# EAGLE design tempsens_tsys01 (EAGLE 7.5.0)
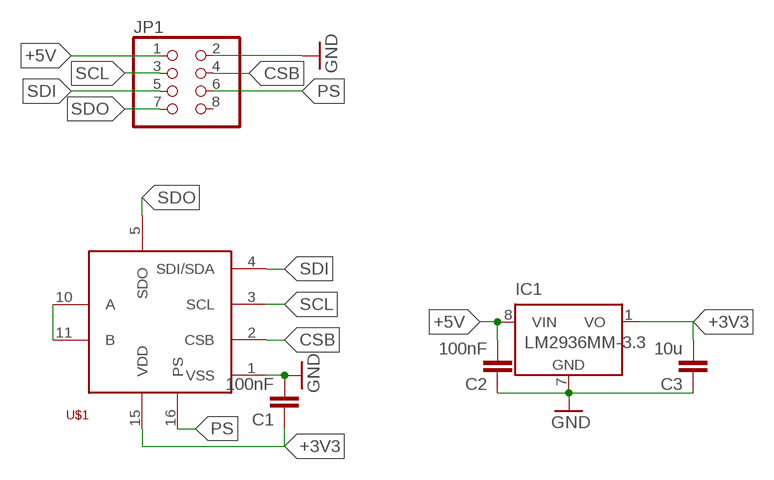
[diagram p0: schematic, sheet 1]

## Parts
C1  100nF  C-EUC0603K  [C0603K]
C2  100nF  C-EUC0603K  [C0603K]
C3  10u  C-EUC0805  [C0805]
IC1  LM2936MM-3.3  [MINI-SO8]
JP1  PINHD-2X4_2.00  [2X04M]
U$1  TSYS01NOPAD  [TSYS01_NOPAD]

## Nets
+3V3: C1.1 C3.2 IC1.1(VO) U$1.15(VDD)
+5V: C2.2 IC1.8(VIN) JP1.1
CSB: JP1.4 U$1.2(CSB)
GND: C1.2 C2.1 C3.1 IC1.7(GND) JP1.2 U$1.1(VSS)
N$3: U$1.10(A) U$1.11(B)
PS: JP1.6 U$1.16(PS)
SCL: JP1.3 U$1.3(SCL)
SDI: JP1.5 U$1.4(SDI/SDA)
SDO: JP1.7 U$1.5(SDO)
Unconnected: JP1.8

## Library data of the parts
C1 C2 = resistor:C-EU: CAPACITOR, European symbol
C3 = rcl:C-EU: CAPACITOR, European symbol
IC1 = national-semiconductor:LM2936?*: Ultra-Low Quiescent Current LDO Voltage Regulator Source: Data sheet <http://www.national.com/ds/LM/LM2936.pdf>; MF: NATIONAL SEMICONDUCTOR; MPN: LM2936MM-3.3/NOPB; OC_FARNELL: 1312706; OC_NEWARK: 41K4517
JP1 = pinhead:PINHD-2X4: PIN HEADER
U$1 = meas:TSYS01

## Board
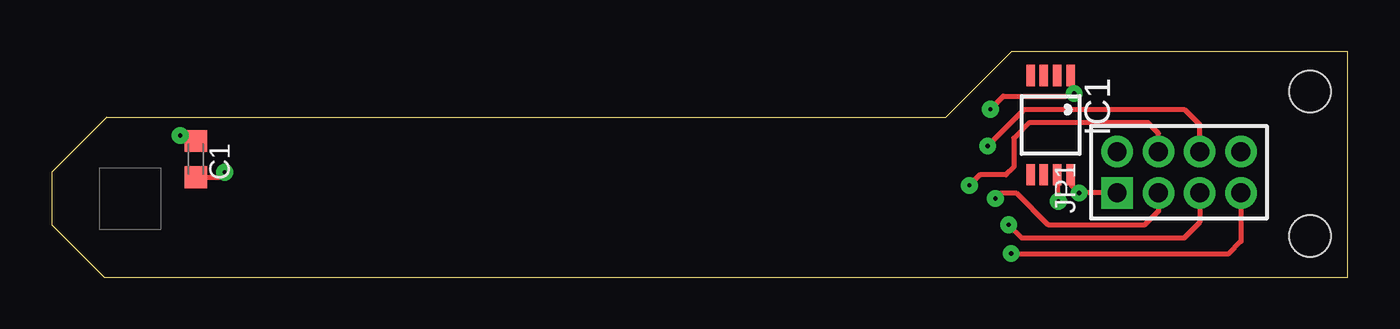
[diagram p1: board, top side]
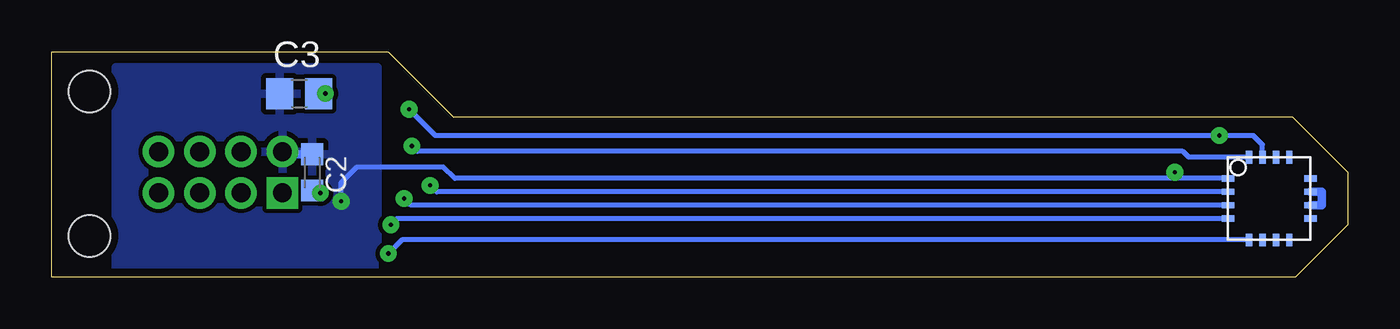
[diagram p2: board, bottom side, seen from below]

Size 62.79 x 10.92 mm. Coordinates in mm from the lower left corner, seen from the top.
Outline: 2.54,0 62.79,0 62.79,10.91 46.48,10.92 43.31,7.75 2.68,7.75 0,5.07 0,2.54 2.54,0
Copper layers (1*16): Top 0.035mm / dielectric 1.5mm / Bottom 0.035mm
Design rules "Fine8_lpt": minimum track width 8mil, minimum drill 8mil, track to track 8mil, track to pad 8mil, pad to pad 8mil, via to via 8mil, smd to smd 0mil, copper to edge 16mil, drill to drill 8mil, minimum pad ring 12mil, minimum via ring 12mil, stop-mask expansion 4mil, vias tented up to drill 0mil, thermal gap 10mil
Holes 2 mm at 60.96,9 60.96,2

### Footprints (pad centres in the part's own frame; a part is rotated, then mirrored left to right if it is on the bottom)
C0603K = smd 1.05 x 1.08: 1 -0.875,0; 2 0.875,0
C0805 = smd 1.3 x 1.5: 1 -0.95,0; 2 0.95,0
MINI-SO8 = smd 0.41 x 1.02: 1 -0.975,-2.4; 2 -0.325,-2.4; 3 0.325,-2.4; 4 0.975,-2.4; 5 0.975,2.4; 6 0.325,2.4; 7 -0.325,2.4; 8 -0.975,2.4
2X04M = drill 0.914 square: 1 -3,-1 | drill 0.914: 2 -3,1; 3 -1,-1; 4 -1,1; 5 1,-1; 6 1,1; 7 3,-1; 8 3,1
TSYS01_NOPAD = smd 0.305 x 0.61: 1 -0.975,-2; 2 -0.325,-2; 3 0.325,-2; 4 0.975,-2; 9 0.975,2; 10 0.325,2; 11 -0.325,2; 12 -0.975,2 | smd 0.61 x 0.305: 5 2,-0.975; 6 2,-0.325; 7 2,0.325; 8 2,0.975; 13 -2,0.975; 14 -2,0.325; 15 -2,-0.325; 16 -2,-0.975

### Placement (x,y rotation side)
C1  6.99,5.71 270 top
C2  50.16,5.08 270 bottom
C3  50.8,8.89 0 bottom
IC1  48.39,7.37 180 top
JP1  54.61,5.08 0 top
U$1  3.81,3.81 270 bottom

### Tracks (layer width: path | path; a pad name or v marks a point on that pad's centre or on a via)
+3V3  (via drill 0.2)
  Top 0.254: v6.22,6.86 6.72,6.86 | 49.36,9.87 IC1.1 49.36,8.98 | v45.47,8.13 46.1,8.76 49.15,8.76 49.36,8.98 | v49.53,8.89 49.45,8.89 49.36,8.98
  Top 0.406: 7.35,6.59 C1.1 6.72,6.86
  Bottom 0.254: U$1.15 4.13,6.42 4.57,6.86 v6.22,6.86 44.2,6.86 v45.47,8.13 | C3.2 v49.53,8.89
+5V  (via drill 0.2)
  Top 0.254: IC1.8 49.36,4.49 v49.77,4.08 JP1.1
  Bottom 0.254: v49.77,4.08 50.16,4.08 C2.2
CSB  (via drill 0.2)
  Top 0.254: JP1.4 53.61,6.97 53.09,7.49 47.37,7.49 46.61,6.73 46.61,5.33 46.23,4.95 44.96,4.95 v44.45,4.45
  Bottom 0.254: U$1.2 44.14,4.13 v44.45,4.45
GND  (via drill 0.2)
  Top 0.254: C1.2 8.14,4.84 v8.38,5.08 | IC1.7 48.71,3.74 v48.77,3.68
  Bottom 0.254: U$1.1 8.38,4.79 | 8.38,4.79 43.27,4.79 43.81,5.33 48.01,5.33 48.77,4.57 v48.77,3.68 | v8.38,5.08 8.38,4.79 | 51.61,5.96 JP1.2
  Bottom 0.406: 51.42,5.96 51.56,6.1 | C2.1 51.61,5.96
  pour Bottom: 46.99,10.16 46.99,0 59.69,0 59.69,10.16
N$3
  Bottom 0.406: U$1.10 1.27,3.48 1.27,4.13 U$1.11
PS  (via drill 0.2)
  Top 0.254: v45.34,6.35 47.12,8.13 54.86,8.13 55.61,7.38 JP1.6
  Bottom 0.254: U$1.16 7.71,5.81 8,6.1 45.08,6.1 v45.34,6.35
SCL  (via drill 0.2)
  Top 0.254: v45.72,3.81 45.99,4.08 46.72,4.08 48.26,2.54 52.96,2.54 53.61,3.19 JP1.3
  Bottom 0.254: U$1.3 45.39,3.48 v45.72,3.81
SDI  (via drill 0.2)
  Top 0.254: v46.35,2.54 46.99,1.91 54.86,1.91 55.61,2.65 JP1.5
  Bottom 0.254: U$1.4 46.06,2.83 v46.35,2.54
SDO  (via drill 0.2)
  Top 0.254: v46.48,1.14 57.02,1.14 57.61,1.73 JP1.7
  Bottom 0.254: U$1.5 45.81,1.81 v46.48,1.14